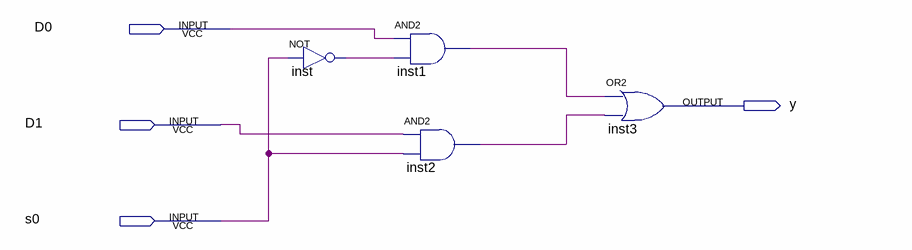
[diagram p0: schematic sheet]
// Quartus schematic 2to1MUX.bdf as structural Verilog: 4 symbols, 4 pins
module \2to1MUX  (
  input  D0,
  input  D1,
  input  s0,
  output y
);

  wire inst1_out, inst2_out, inst_out;

  not inst (inst_out, s0);
  and inst1 (inst1_out, D0, inst_out);
  and inst2 (inst2_out, D1, s0);
  or inst3 (y, inst1_out, inst2_out);
endmodule
